# EAGLE design GPS_Breakout (EAGLE 5.11)
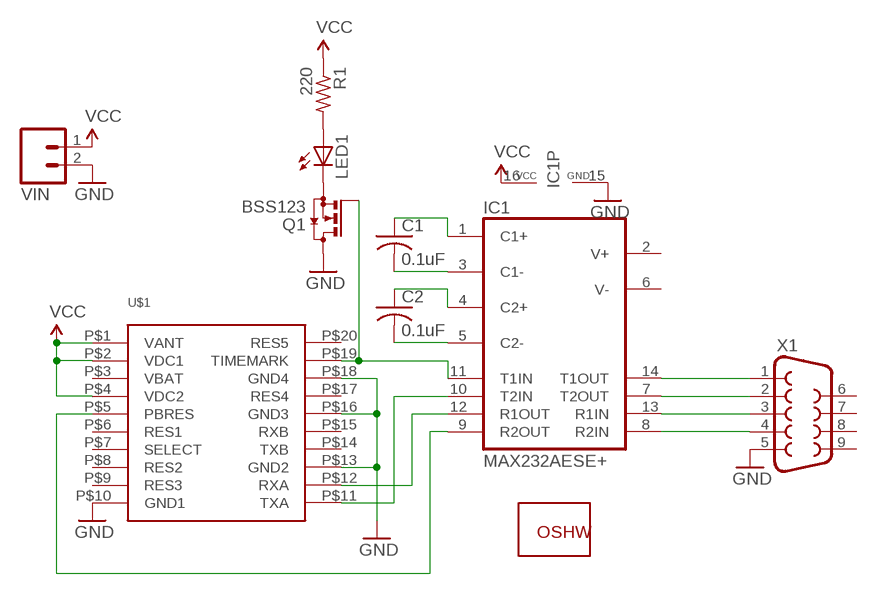
[diagram p0: schematic, sheet 1]

## Parts
C1  0.1uF  C-US025-025X050  [C025-025X050]
C2  0.1uF  C-US025-025X050  [C025-025X050]
GOLD_ORB_SM1  OSHWLOGO_GOLD_ORB_SM  [OSHW2]
IC1  MAX232AESE+  MAX232ECWE  [SO16L]
LED1  LED3MM  [LED3MM]
Q1  BSS123  [SOT23]
R1  220  R-US_0204/7  [0204/7]
U$1  ET-102_V2.0  [10X2_HEADER]
VIN  M02PTH  [1X02]
X1  DB9  [DB9]

## Nets
GND: IC1.15(GND) Q1.3(D) U$1.P$10(GND1) U$1.P$13(GND2) U$1.P$16(GND3) U$1.P$18(GND4) VIN.2 X1.5
N$1: IC1.11(T1IN) Q1.1(G) U$1.P$19(TIMEMARK)
N$2: IC1.14(T1OUT) X1.1
N$3: IC1.10(T2IN) U$1.P$11(TXA)
N$4: IC1.7(T2OUT) X1.2
N$5: IC1.12(R1OUT) U$1.P$12(RXA)
N$6: IC1.13(R1IN) X1.3
N$7: LED1.K(C) Q1.2(S)
N$8: LED1.A R1.2
N$9: IC1.8(R2IN) X1.4
N$10: IC1.9(R2OUT) U$1.P$5(PBRES)
N$11: C1.1 IC1.1(C1+)
N$12: C1.2 IC1.3(C1-)
N$13: C2.1 IC1.4(C2+)
N$14: C2.2 IC1.5(C2-)
VCC: IC1.16(VCC) R1.1 U$1.P$1(VANT) U$1.P$2(VDC1) U$1.P$4(VDC2) VIN.1
Unconnected: IC1.2(V+) IC1.6(V-) U$1.P$6(RES1) U$1.P$7(SELECT) U$1.P$8(RES2) U$1.P$9(RES3) U$1.P$14(TXB) U$1.P$15(RXB) U$1.P$17(RES4) U$1.P$20(RES5) X1.6 X1.7 X1.8 X1.9

## Power pins joined to a net without a drawn wire
VBAT: U$1.P$3(VBAT)

## Library data of the parts
C1 C2 = adafruit:C-US: CAPACITOR, American symbol
GOLD_ORB_SM1 = NBitWonder:OSHWLOGO: These are Open-Source Hardware logos.
IC1 = maxim:MAX232ECWE: RS232 TRANSEIVER
LED1 = adafruit:LED: LED OSRAM: - CHIPLED LG R971, LG N971, LY N971, LG Q971, LY Q971, LO R971, LY R971 LH N974, LH R974 LS Q976, LO Q976, LY Q976 LO Q996 - Hyper CHIPLED LW Q18S LB Q993, LB Q99A, LB R99A - SideLED LS A670, LO A670, LY A670, LG A670, LP A670 LB A673, LV A673, LT A673, LW A673 LH A674 LY A675 LS A676, LA A676, LO A676, LY A676, LW A676 LS A679, LY A679, LG A679 - Hyper Micro SIDELED® LS Y876, LA Y876, LO Y876, LY Y876 LT Y87S - SmartLED LW L88C, LW L88S LB L89C, LB L89S, LG L890 LS L89K, LO L89K, LY L89K LS L896, LA L896, LO L896, LY L896 - TOPLED LS T670, LO T670, LY T670, LG T670, LP T670 LSG T670, LSP T670, LSY T670, LOP T670, LYG T670 LG T671, LOG T671, LSG T671 LB T673, LV T673, LT T673, LW T673 LH T674 LS T676, LA T676, LO T676, LY T676, LB T676, LH T676, LSB T676, LW T676 LB T67C, LV T67C, LT T67C, LS T67K, LO T67K, LY T67K, LW E67C LS E67B, LA E67B, LO E67B, LY E67B, LB E67C, LV E67C, LT E67C LW T67C LS T679, LY T679, LG T679 LS T770, LO T770, LY T770, LG T770, LP T770 LB T773, LV T773, LT T773, LW T773 LH T774 LS E675, LA E675, LY E675, LS T675 LS T776, LA T776, LO T776, LY T776, LB T776 LHGB T686 LT T68C, LB T68C - Hyper Mini TOPLED® LB M676 - Mini TOPLED Santana® LG M470 LS M47K, LO M47K, LY M47K Source: http://www.osram.convergy.de/
Q1 = transistor-small-signal:BSS123: N-CHANNEL MOS FET
R1 = adafruit:R-US_: RESISTOR, American symbol
U$1 = custom_library:ET-102_V2.0
VIN = SparkFun:M02: Header 2 Standard 2-pin 0.1" header. Use with straight break away headers (SKU : PRT-00116), right angle break away headers (PRT-00553), swiss pins (PRT-00743), machine pins (PRT-00117), and female headers (PRT-00115). Molex polarized connector foot print use with SKU : PRT-08233 with associated crimp pins and housings.
X1 = SparkFun:DB9: DB9 Connector Standard DB9 (D-Sub 9) serial connector. Can be used for CAN bus as well as RS485 and RS232. Footprint production proven. Spark Fun Electronics SKU : PRT-00429

## Board
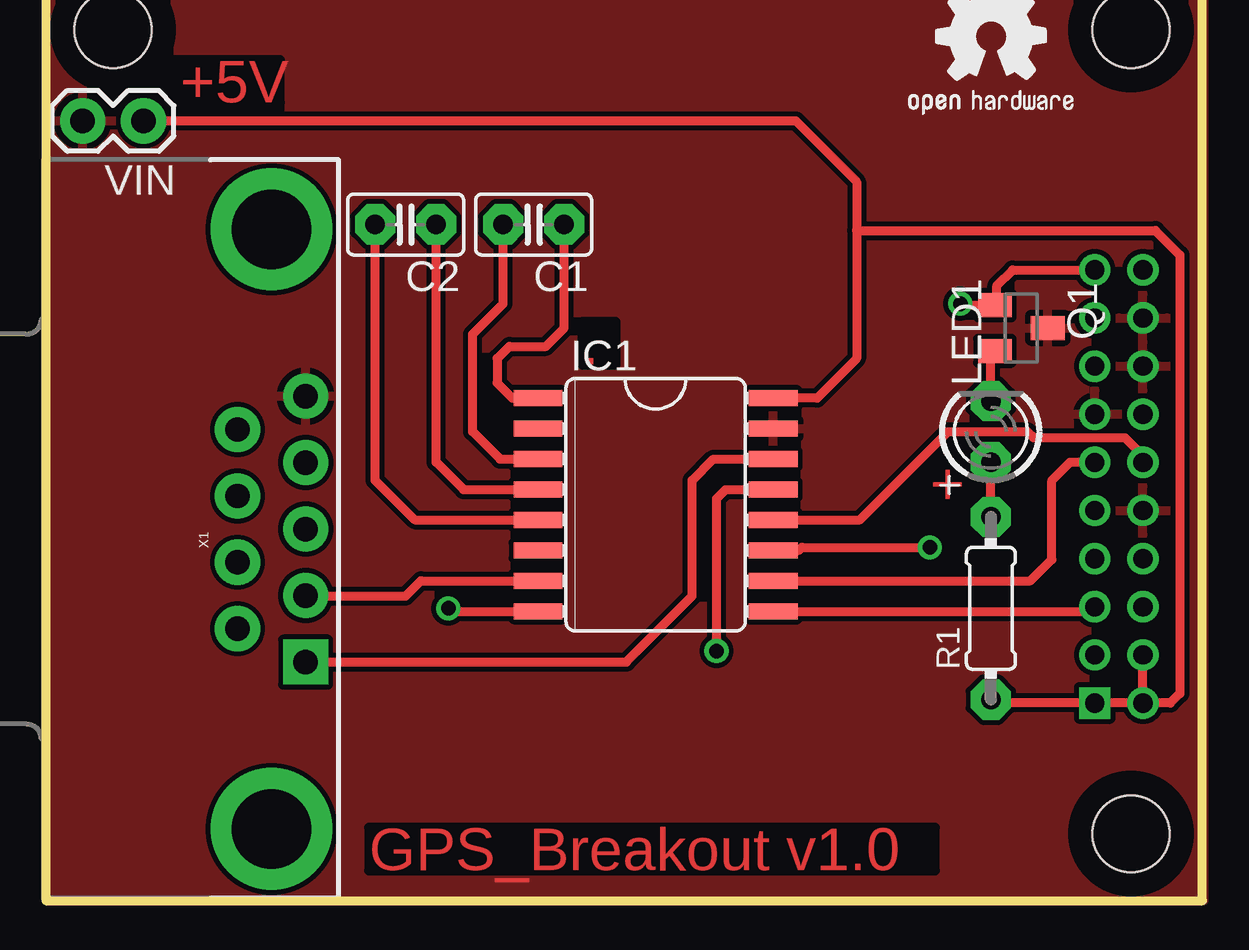
[diagram p1: board, top side]
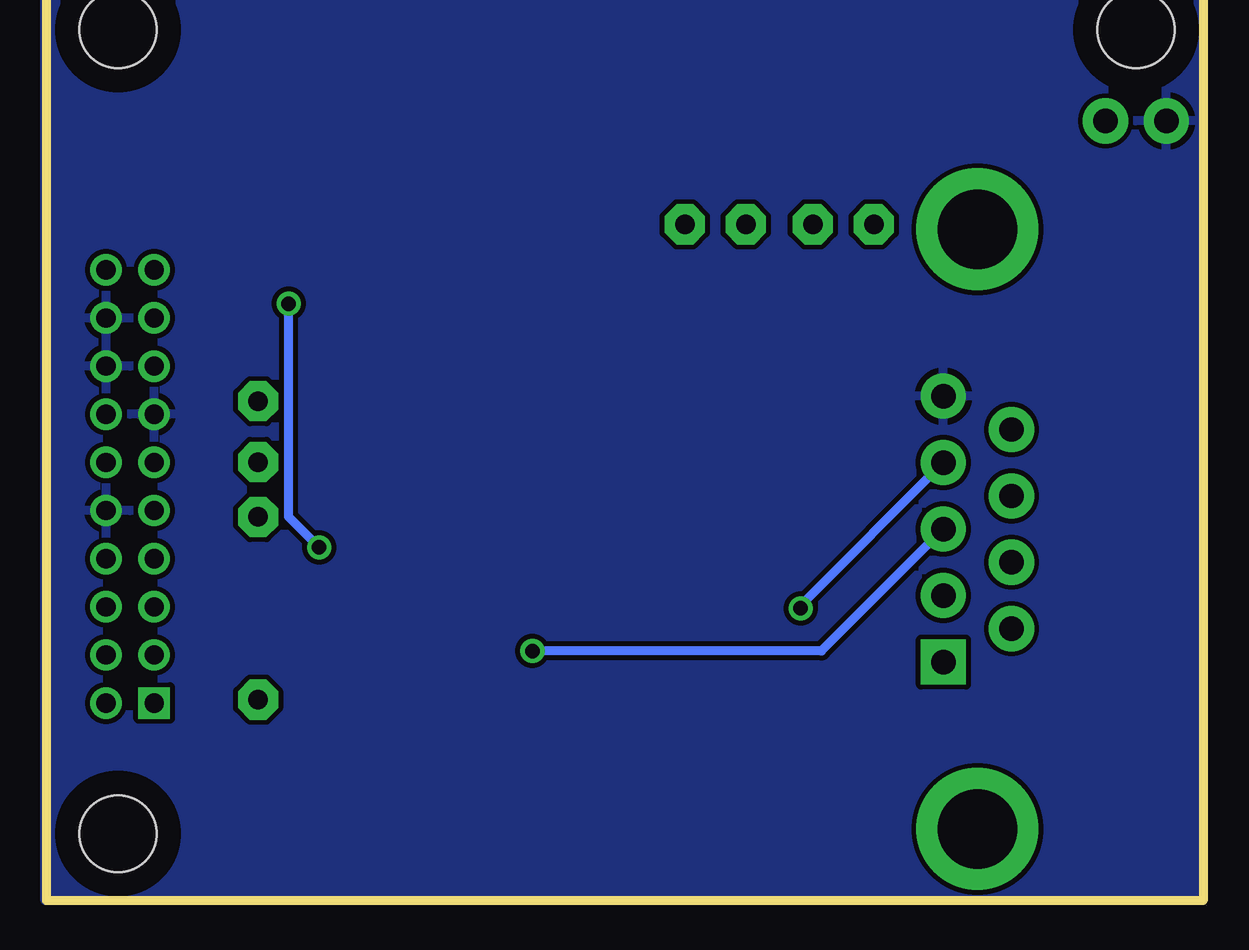
[diagram p2: board, bottom side, seen from below]

No outline drawn. Coordinates in mm, seen from the top.
Copper layers (1*16): Top 0.035mm / dielectric 1.5mm / Bottom 0.035mm
Design rules "default": minimum track width 10mil, minimum drill 24mil, track to track 8mil, track to pad 8mil, pad to pad 8mil, via to via 8mil, smd to smd 8mil, copper to edge 40mil, drill to drill 8mil, minimum pad ring 10mil, minimum via ring 8mil, stop-mask expansion 4mil, vias tented up to drill 0mil, thermal gap 10mil
Holes 3.2 mm at 45.21,36.32 45.21,2.79 2.79,36.32
Milling: 4 lines

### Footprints (pad centres in the part's own frame; a part is rotated, then mirrored left to right if it is on the bottom)
C025-025X050 = drill 0.813 pad 1.676 octagon: 1 -1.27,0; 2 1.27,0
SO16L = smd 0.66 x 2.032: 1 -4.445,-4.902; 2 -3.175,-4.902; 3 -1.905,-4.902; 4 -0.635,-4.902; 5 0.635,-4.902; 6 1.905,-4.902; 7 3.175,-4.902; 8 4.445,-4.902; 9 4.445,4.902; 10 3.175,4.902; 11 1.905,4.902; 12 0.635,4.902; 13 -0.635,4.902; 14 -1.905,4.902; 15 -3.175,4.902; 16 -4.445,4.902
LED3MM = drill 0.813 pad 1.676 octagon: A -1.27,0; K 1.27,0
SOT23 = smd 1 x 1.4: 1 -0.95,-1.1; 2 0.95,-1.1; 3 0,1.1
0204/7 = drill 0.813 pad 1.676 octagon: 1 -3.81,0; 2 3.81,0
10X2_HEADER = drill 0.8 square: P$1 -1.003,-9.03 | drill 0.8 round: P$2 1.003,-9.03; P$3 -1.003,-7.023; P$4 1.003,-7.023; P$5 -1.003,-5.016; P$6 1.003,-5.016; P$7 -1.003,-3.01; P$8 1.003,-3.01; P$9 -1.003,-1.003; P$10 1.003,-1.003; P$11 -1.003,1.003; P$12 1.003,1.003; P$13 -1.003,3.01; P$14 1.003,3.01; P$15 -1.003,5.016; P$16 1.003,5.016; P$17 -1.003,7.023; P$18 1.003,7.023; P$19 -1.003,9.03; P$20 1.003,9.03
1X02 = drill 1.016 pad 1.88 round: 1 0,0; 2 2.54,0
DB9 = drill 1.016 pad 1.88 square: 1 -5.54,-1.42 | drill 1.016 pad 1.88 round: 2 -2.77,-1.42; 3 0,-1.42; 4 2.77,-1.42; 5 5.54,-1.42; 6 -4.15,1.42; 7 -1.38,1.42; 8 1.38,1.42; 9 4.15,1.42 | drill 3.302 pad 5.08 round: G1 -12.5,0; G2 12.5,0

### Placement (x,y rotation side)
C1  20.32,28.19 180 top
C2  14.99,28.19 180 top
GOLD_ORB_SM1  35.56,31.75 0 top
IC1  25.4,16.51 270 top
LED1  39.37,19.56 90 top
Q1  40.64,23.88 270 top
R1  39.37,12.19 90 top
U$1  44.7,17.27 0 top
VIN  4.06,32.51 180 top
X1  9.4,15.49 90 top

### Tracks (layer width: path | path; a pad name or v marks a point on that pad's centre or on a via)
GND
  pour Top: 0,0 48.26,0 48.26,39.12 0,39.12
  pour Bottom: 0,0 48.26,0 48.26,39.37 0,39.37
N$1  (via drill 0.6)
  Top 0.381: U$1.P$19 40.27,26.3 39.62,25.65 39.62,24.91 Q1.1 38.17,24.83 v38.1,24.89 | IC1.11 31.37,14.61 31.5,14.73 v36.83,14.73
  Bottom 0.381: v38.1,24.89 38.1,16 v36.83,14.73
N$2
  Top 0.381: X1.1 24.18,9.95 26.92,12.7 26.92,17.53 27.81,18.41 IC1.14
N$3
  Top 0.381: IC1.10 41.02,13.34 41.91,14.22 41.91,17.53 42.67,18.29 43.69,18.29 U$1.P$11
N$4
  Top 0.381: IC1.7 15.62,13.34 14.99,12.7 10.84,12.7 X1.2
N$5
  Top 0.381: U$1.P$12 45.71,18.55 44.96,19.3 41.15,19.3 40.89,19.56 37.59,19.56 33.91,15.88 IC1.12
N$6  (via drill 0.6)
  Top 0.381: IC1.13 28.32,17.14 27.94,16.76 v27.94,10.41
  Bottom 0.381: v27.94,10.41 15.9,10.41 X1.3
N$7
  Top 0.381: LED1.K 39.37,22.76 Q1.2
N$8
  Top 0.381: R1.2 LED1.A
N$9  (via drill 0.6)
  Top 0.381: IC1.8 16.89,12.06 v16.76,12.19
  Bottom 0.381: v16.76,12.19 16.76,12.32 X1.4
N$10
  Top 0.381: IC1.9 43.51,12.06 U$1.P$5
N$11
  Top 0.381: IC1.1 19.43,20.95 18.8,21.59 18.8,22.61 19.3,23.11 20.83,23.11 21.59,23.88 C1.1
N$12
  Top 0.381: IC1.3 18.92,18.41 17.78,19.56 17.78,23.62 19.05,24.89 C1.2
N$13
  Top 0.381: IC1.4 17.4,17.14 16.26,18.29 C2.1
N$14
  Top 0.381: IC1.5 15.37,15.88 13.72,17.53 C2.2
VCC
  Top 0.381: VIN.1 31.24,32.51 33.78,29.97 33.78,27.94 | U$1.P$2 U$1.P$4 | U$1.P$2 U$1.P$1 39.51,8.24 R1.1 | IC1.16 32.13,20.95 33.78,22.61 33.78,27.94 | 33.78,27.94 46.23,27.94 47.24,26.92 47.24,8.64 46.85,8.24 U$1.P$2

### Text on the board
Top: +5V | . | + | GPS_Breakout v1.0